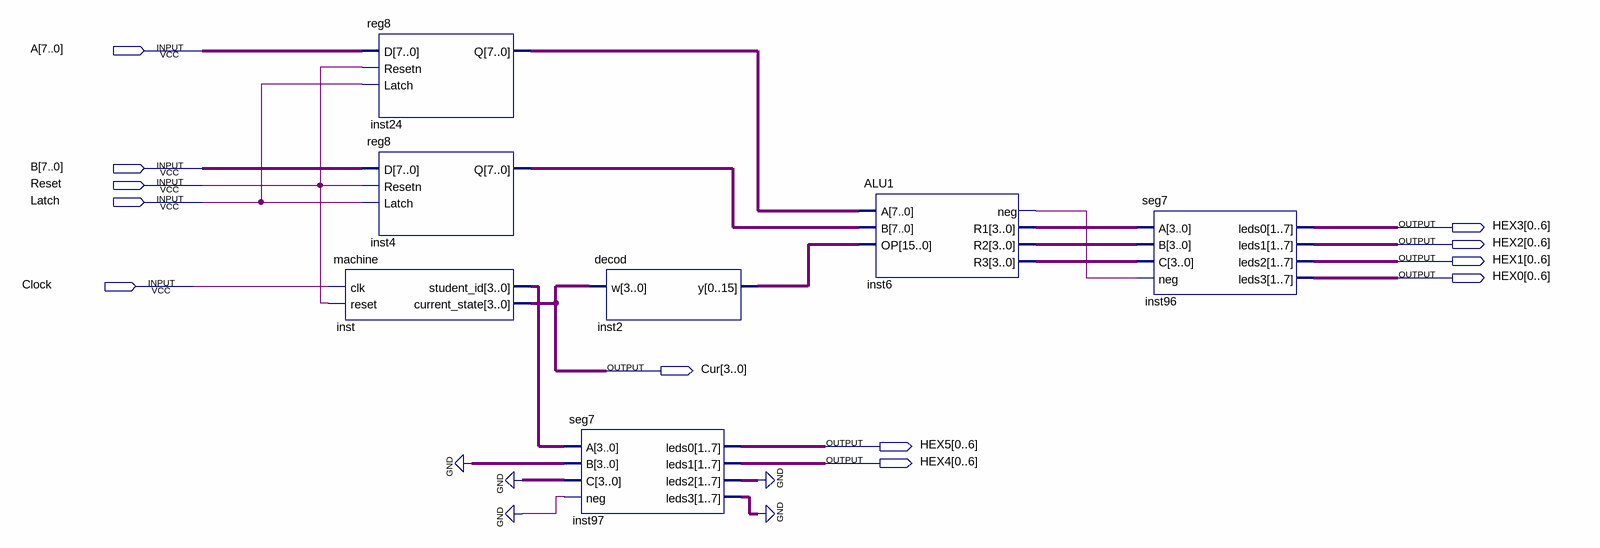
[diagram p0: schematic sheet]
// Quartus schematic Lab6.bdf as structural Verilog: 7 symbols, 12 pins
module Lab6 (
  input  [7:0] A,
  input  [7:0] B,
  input  Reset,
  input  Latch,
  input  Clock,
  output [0:6] HEX3,
  output [0:6] HEX2,
  output [0:6] HEX1,
  output [0:6] HEX0,
  output [3:0] Cur,
  output [0:6] HEX5,
  output [0:6] HEX4
);

  wire inst6_neg;
  wire [3:0] inst6_r1, inst6_r2, inst6_r3, inst_student_id;
  wire [6:0] inst97_leds2, inst97_leds3;
  wire [7:0] inst4_q, inst24_q;
  wire [15:0] inst2_y;

  machine inst (.clk(Clock), .reset(Reset), .student_id(inst_student_id), .current_state(Cur));
  reg8 inst24 (.D(A), .Resetn(Reset), .Latch(Latch), .Q(inst24_q));
  reg8 inst4 (.D(B), .Resetn(Reset), .Latch(Latch), .Q(inst4_q));
  decod inst2 (.w(Cur), .y(inst2_y));
  seg7 inst97 (
    .A(inst_student_id), .B(4'b0000), .C(4'b0000), .neg(1'b0), .leds0(HEX5), .leds1(HEX4),
    .leds2(inst97_leds2), .leds3(inst97_leds3));
  ALU1 inst6 (.A(inst24_q), .B(inst4_q), .OP(inst2_y), .neg(inst6_neg), .R1(inst6_r1), .R2(inst6_r2), .R3(inst6_r3));
  seg7 inst96 (
    .A(inst6_r1), .B(inst6_r2), .C(inst6_r3), .neg(inst6_neg), .leds0(HEX3), .leds1(HEX2), .leds2(HEX1),
    .leds3(HEX0));
  // also tied to GND on the sheet: {inst97_leds2[0], inst97_leds2[1], inst97_leds2[2], inst97_leds2[3], inst97_leds2[4], inst97_leds2[5], inst97_leds2[6], inst97_leds3[0], inst97_leds3[1], inst97_leds3[2], inst97_leds3[3], inst97_leds3[4], inst97_leds3[5], inst97_leds3[6]}
endmodule
